# Altium project PCB_Project.PrjPcb
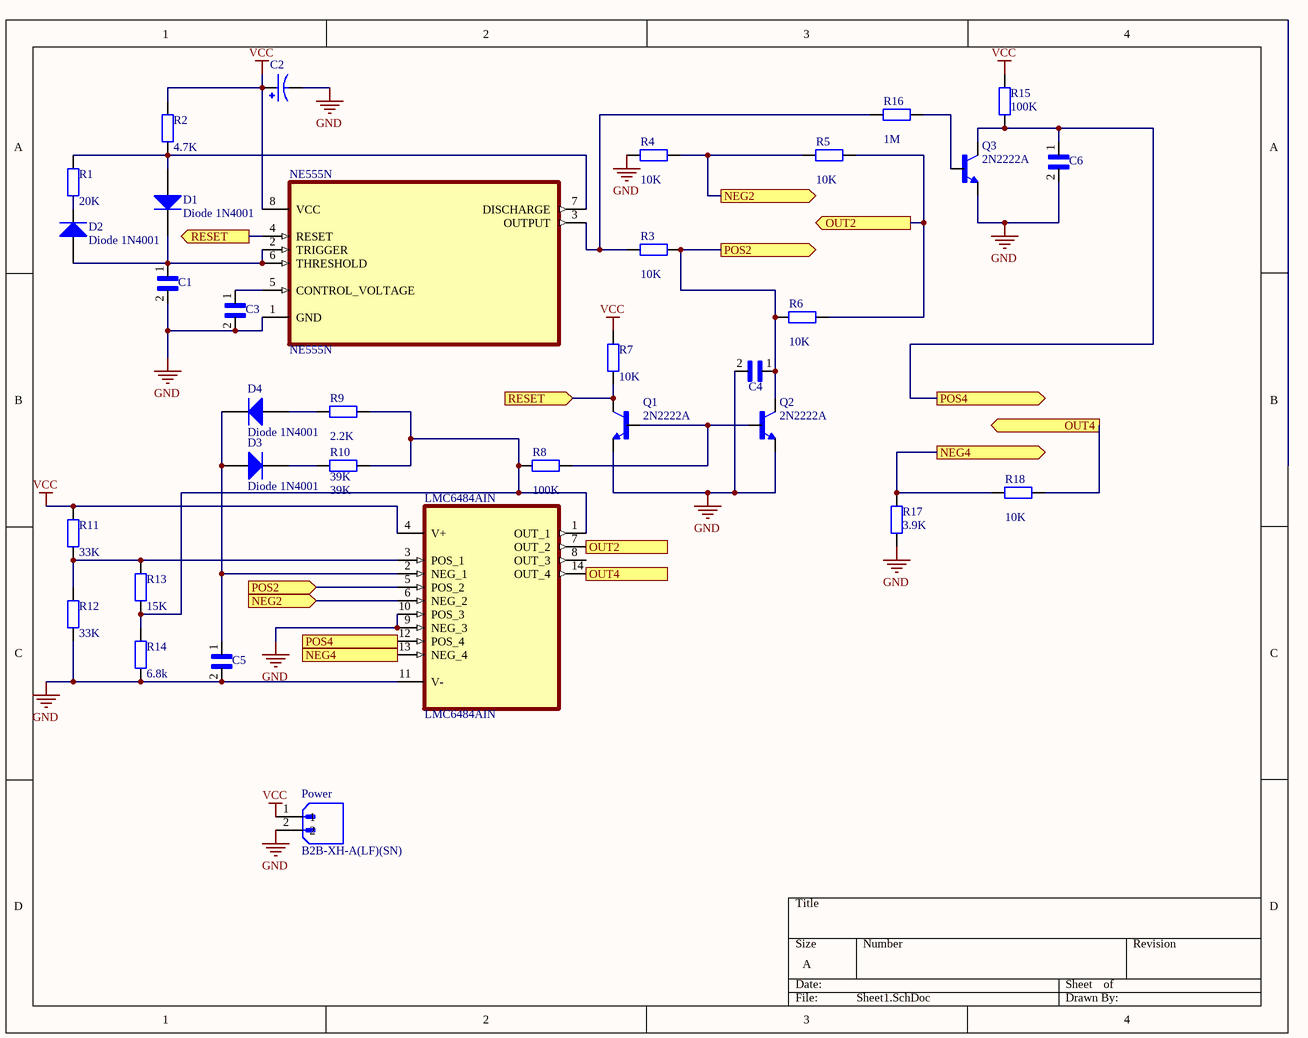
[diagram p0: Sheet1.SchDoc]
1 sheet, 34 parts. Net scope: flat (ports and power ports of the same name join across sheets).

## Sheet Sheet1.SchDoc
size A; SheetNumber: 1; SheetTotal: 1

### Parts
C1  ECQE4103JF  [CAPRR750W60L1030T430H740]  (value not drawn)
C2  EEUEB1H470  [CAPPRD250W50D630H1500]  (value not drawn)
C3  ECQE4103JF  [CAPRR750W60L1030T430H740]  (value not drawn)
C4  FA16C0G2A104JRU06  [CAPRB250W50L550T350H600]  (value not drawn)
C5  FA16C0G2A104JRU06  [CAPRB250W50L550T350H600]  (value not drawn)
C6  ECQE4103JF  [CAPRR750W60L1030T430H740]  (value not drawn)
D1  Diode 1N4001  [DO-41]
D2  Diode 1N4001  [DO-41]
D3  Diode 1N4001  [DO-41]
D4  Diode 1N4001  [DO-41]
LMC6484AIN  LMC6484AIN  [DIP254P762X508-14]
NE555N  NE555N  [DIP254P762X533-8]
Power  B2B-XH-A(LF)(SN)  [JST_B2B-XH-A(LF)(SN)]
Q1  2N2222A  [TO92254P470H750-3]
Q2  2N2222A  [TO92254P470H750-3]
Q3  2N2222A  [TO92254P470H750-3]
R1  20K  [AXIAL-0.4]
R2  4.7K  [AXIAL-0.4]
R3  10K  [AXIAL-0.4]
R4  10K  [AXIAL-0.4]
R5  10K  [AXIAL-0.4]
R6  10K  [AXIAL-0.4]
R7  10K  [AXIAL-0.4]
R8  100K  [AXIAL-0.4]
R9  2.2K  [AXIAL-0.4]
R10  39K  [AXIAL-0.4]
R11  33K  [AXIAL-0.4]
R12  33K  [AXIAL-0.4]
R13  15K  [AXIAL-0.4]
R14  6.8K  [AXIAL-0.4]
R15  100K  [AXIAL-0.4]
R16  value 1M  [AXIAL-0.4]  (hidden comment: 10K)
R17  3.9K  [AXIAL-0.4]
R18  10K  [AXIAL-0.4]

### Ports
NEG2 (in), NEG2 (out), NEG4 (in), NEG4 (out), OUT2 (out), OUT4 (out), POS2 (in), POS2 (out), POS4 (in), POS4 (out), RESET (in), RESET (out)

### Nets
GND: C1.2 C2.N C3.2 C4.2 C5.2 C6.2 LMC6484AIN.9(NEG_3) LMC6484AIN.10(POS_3) LMC6484AIN.11(V-) NE555N.1(GND) Power.2 Q1.1(E) Q2.1(E) Q3.1(E) R4.1 R12.2 R14.2 R17.2
VCC: C2.P LMC6484AIN.4(V+) NE555N.8(VCC) Power.1 R2.1 R7.1 R11.1 R15.1
NetC1_1: C1.1 D1.2(K) D2.1(A) NE555N.2(TRIGGER) NE555N.6(THRESHOLD)
NetC3_1: C3.1 NE555N.5(CONTROL_VOLTAGE)
NetC4_1: C4.1 LMC6484AIN.5(POS_2) Q2.3(C) R3.2 R6.1 ; port POS2
NetC5_1: C5.1 D3.1(A) D4.2(K) LMC6484AIN.2(NEG_1)
NetC6_1: C6.1 LMC6484AIN.12(POS_4) Q3.3(C) R15.2 ; port POS4
NetD1_1: D1.1(A) NE555N.7(DISCHARGE) R1.1 R2.2
NetD2_2: D2.2(K) R1.2
NetD3_2: D3.2(K) R10.1
NetD4_1: D4.1(A) R9.1
NetLMC6484AIN_1: LMC6484AIN.1(OUT_1) R8.1 R9.2 R10.2 R13.2 R14.1
NetLMC6484AIN_3: LMC6484AIN.3(POS_1) R11.2 R12.1 R13.1
NetLMC6484AIN_6: LMC6484AIN.6(NEG_2) R4.2 R5.1 ; port NEG2
NetLMC6484AIN_7: LMC6484AIN.7(OUT_2) R5.2 R6.2 ; port OUT2
NetLMC6484AIN_13: LMC6484AIN.13(NEG_4) R17.1 R18.1 ; port NEG4
NetLMC6484AIN_14: LMC6484AIN.14(OUT_4) R18.2 ; port OUT4
NetNE555N_3: NE555N.3(OUTPUT) R3.1 R16.1
NetNE555N_4: NE555N.4(RESET) Q1.3(C) R7.2 ; port RESET
NetQ1_2: Q1.2(B) Q2.2(B) R8.2
NetQ3_2: Q3.2(B) R16.2

Not connected (* = marked no-connect by the designer): LMC6484AIN 8(OUT_3)

### Library data of the parts
C2 = EEUEB1H470: CAP ALUM 47UF 20% 50V RADIAL; MP: EEU-EB1H470; MF: Panasonic Electronic Components; SnapEDA_Link: https://www.snapeda.com/parts/EEU-EB1H470/Panasonic/view-part/6222294/?ref=snap; Availability: In Stock; Check_prices: https://www.snapeda.com/parts/EEU-EB1H470/Panasonic/view-part/6222294/?ref=eda; Package: RADIAL-2 Panasonic; Price: None; Value: *
C4 C5 = FA16C0G2A104JRU06: 0.1 ÂµF Â±5% 100V Ceramic Capacitor C0G, NP0 Radial; MF: TDK Corporation; SnapEDA_Link: https://www.snapeda.com/parts/FA16C0G2A104JRU06/TDK/view-part/?ref=snap; Purchase-URL: https://pricing.snapeda.com/search/part/FA16C0G2A104JRU06/?ref=eda; Value: *; Digi-Key_Part_Number: 445-175390-1-ND; Package: Radial TDK; Check_prices: https://www.snapeda.com/parts/FA16C0G2A104JRU06/TDK/view-part/?ref=eda; MP: FA16C0G2A104JRU06
D1-D4 = Diode 1N4001: 1 Amp General Purpose Rectifier; Published: 8-Jun-2000; LatestRevisionDate: 17-Jul-2002; LatestRevisionNote: Re-released for DXP Platform.; DatasheetVersion: 1998; PackageVersion: Aug-1999; PackageReference: DO-41; Publisher: Altium Limited; PackageDescription: Diode, Axial; Body 5.2 x 2.7 mm (LxDia. max), Lead Dia. 0.86 mm (max); Code_JEDEC: DO-204-AL; ComponentLink1Description: Manufacturer Link; ComponentLink1URL: http://www.fairchildsemi.com/; ComponentLink2Description: Datasheet; ComponentLink2URL: http://www.fairchildsemi.com/ds/1N%2F1N4001.pdf
LMC6484AIN = LMC6484AIN: General Purpose Amplifier 4 Circuit Rail-to-Rail 14-DIP; MF: Texas Instruments; MP: LMC6484AIN; Price: None; Availability: Bad; Check_prices: https://www.snapeda.com/parts/LMC6484AIN/Texas%20Instruments/view-part/185372/?ref=eda; Package: DIP-14 Texas Instruments; SnapEDA_Link: https://www.snapeda.com/parts/LMC6484AIN/Texas%20Instruments/view-part/185372/?ref=snap; Value: *; Purchase-URL: https://pricing.snapeda.com/search/part/LMC6484AIN/?ref=eda
NE555N = NE555N: 555 Type, Timer/Oscillator (Single) IC 500kHz 8-DIP; MF: STMicroelectronics; SnapEDA_Link: https://www.snapeda.com/parts/NE555N/STMicroelectronics/view-part/?ref=snap; MP: NE555N; Availability: In Stock; Price: None; Value: *; Check_prices: https://www.snapeda.com/parts/NE555N/STMicroelectronics/view-part/?ref=eda; Package: DIP-8 STMicroelectronics; Purchase-URL: https://pricing.snapeda.com/search/part/NE555N/?ref=eda
Power = B2B-XH-A(LF)(SN): Connector Header Through Hole 2 position 0.098 (2.50mm); MF: JST Sales; SnapEDA_Link: https://www.snapeda.com/parts/B2B-XH-A(LF)(SN)/JST+Sales+America+Inc./view-part/?ref=snap; Package: None; Value: *; MP: B2B-XH-A(LF)(SN); Check_prices: https://www.snapeda.com/parts/B2B-XH-A(LF)(SN)/JST+Sales+America+Inc./view-part/?ref=eda
Q1-Q3 = 2N2222A: Bipolar (BJT) Transistor NPN 40 V 600 mA 250MHz 625 mW Through Hole TO-92; MF: Diotec Semiconductor; Package: TO-92-3 Diotec; Check_prices: https://www.snapeda.com/parts/2N2222A/Diotec/view-part/?ref=eda; Value: *; Purchase-URL: https://pricing.snapeda.com/search/part/2N2222A/?ref=eda; Availability: In Stock; SnapEDA_Link: https://www.snapeda.com/parts/2N2222A/Diotec/view-part/?ref=snap; MP: 2N2222A; Price: None
R1-R18 = Res2: Resistor; Published: 8-Jun-2000; LatestRevisionDate: 17-Jul-2002; LatestRevisionNote: Re-released for DXP Platform.; PackageReference: AXIAL-0.4; Publisher: Altium Limited; PackageDescription: Axial Device, Thru-Hole; 2 Leads; 0.4 in Pin Spacing
  R1: Value: 20K
  R2: Value: 4.7K
  R3-R7 R18: Value: 10K
  R8 R15: Value: 100K
  R9: Value: 2.2K
  R10: Value: 39K
  R11 R12: Value: 33K
  R13: Value: 15K
  R14: Value: 6.8k
  R17: Value: 3.9K
C1 C3 C6 = ECQE4103JF: MP: ECQE4103JF; Availability: Unavailable; Package: None; Value: *; Price: None